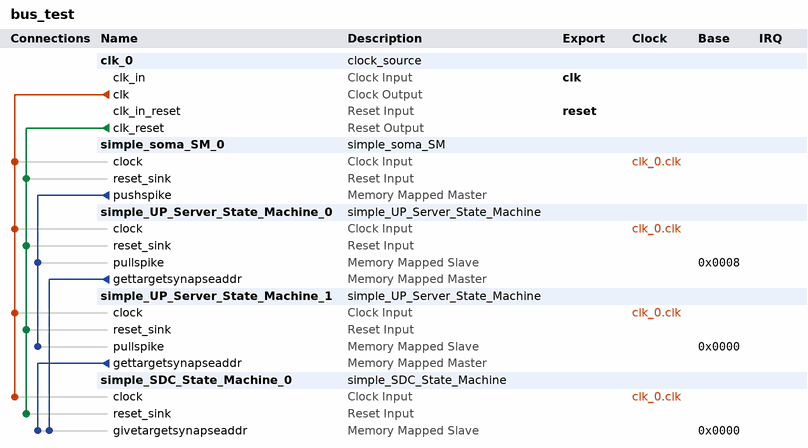
[diagram p0: system contents]
# Platform Designer (Qsys) system bus_test, Cyclone V 5CSEBA6U23I7
# Parameters at their usual value, and those the tool derives, are not listed.
package require -exact qsys 21.1
create_system bus_test
set_project_property DEVICE_FAMILY {Cyclone V}
set_project_property DEVICE 5CSEBA6U23I7

add_instance clk_0 clock_source 21.1
set_instance_parameter_value clk_0 clockFrequency 50000000

add_instance simple_soma_SM_0 simple_soma_SM 1.0
set_instance_parameter_value simple_soma_SM_0 ADDR_WIDTH 2
set_instance_parameter_value simple_soma_SM_0 DATA_WIDTH 8
set_instance_parameter_value simple_soma_SM_0 THRESHOLD 10
set_instance_parameter_value simple_soma_SM_0 UPLOAD_SERVER_ADDRESS 1

add_instance simple_UP_Server_State_Machine_0 simple_UP_Server_State_Machine 1.0
set_instance_parameter_value simple_UP_Server_State_Machine_0 ADDR_WIDTH 2
set_instance_parameter_value simple_UP_Server_State_Machine_0 DATA_WIDTH 8

add_instance simple_UP_Server_State_Machine_1 simple_UP_Server_State_Machine 1.0
set_instance_parameter_value simple_UP_Server_State_Machine_1 ADDR_WIDTH 2
set_instance_parameter_value simple_UP_Server_State_Machine_1 DATA_WIDTH 8

add_instance simple_SDC_State_Machine_0 simple_SDC_State_Machine 1.0
set_instance_parameter_value simple_SDC_State_Machine_0 ADDR_WIDTH 7
set_instance_parameter_value simple_SDC_State_Machine_0 DATA_WIDTH 8

# connections
add_connection clk_0.clk simple_SDC_State_Machine_0.clock clock
add_connection clk_0.clk simple_soma_SM_0.clock clock
add_connection clk_0.clk simple_UP_Server_State_Machine_0.clock clock
add_connection clk_0.clk simple_UP_Server_State_Machine_1.clock clock
add_connection clk_0.clk_reset simple_SDC_State_Machine_0.reset_sink reset
add_connection clk_0.clk_reset simple_soma_SM_0.reset_sink reset
add_connection clk_0.clk_reset simple_UP_Server_State_Machine_0.reset_sink reset
add_connection clk_0.clk_reset simple_UP_Server_State_Machine_1.reset_sink reset
add_connection simple_soma_SM_0.pushspike simple_UP_Server_State_Machine_0.pullspike avalon
set_connection_parameter_value simple_soma_SM_0.pushspike/simple_UP_Server_State_Machine_0.pullspike baseAddress 0x0008
add_connection simple_soma_SM_0.pushspike simple_UP_Server_State_Machine_1.pullspike avalon
set_connection_parameter_value simple_soma_SM_0.pushspike/simple_UP_Server_State_Machine_1.pullspike baseAddress 0x0000
add_connection simple_UP_Server_State_Machine_0.gettargetsynapseaddr simple_SDC_State_Machine_0.givetargetsynapseaddr avalon
set_connection_parameter_value simple_UP_Server_State_Machine_0.gettargetsynapseaddr/simple_SDC_State_Machine_0.givetargetsynapseaddr baseAddress 0x0000
add_connection simple_UP_Server_State_Machine_1.gettargetsynapseaddr simple_SDC_State_Machine_0.givetargetsynapseaddr avalon
set_connection_parameter_value simple_UP_Server_State_Machine_1.gettargetsynapseaddr/simple_SDC_State_Machine_0.givetargetsynapseaddr baseAddress 0x0000

# exported interfaces
add_interface clk clock sink
set_interface_property clk EXPORT_OF clk_0.clk_in
add_interface reset reset sink
set_interface_property reset EXPORT_OF clk_0.clk_in_reset

set_interconnect_requirement {$system} qsys_mm.clockCrossingAdapter HANDSHAKE
set_interconnect_requirement {$system} qsys_mm.enableEccProtection FALSE
set_interconnect_requirement {$system} qsys_mm.insertDefaultSlave FALSE
set_interconnect_requirement {$system} qsys_mm.maxAdditionalLatency 1

save_system bus_test.qsys
